# EAGLE design esptoy_v13 (EAGLE 7.7.0)
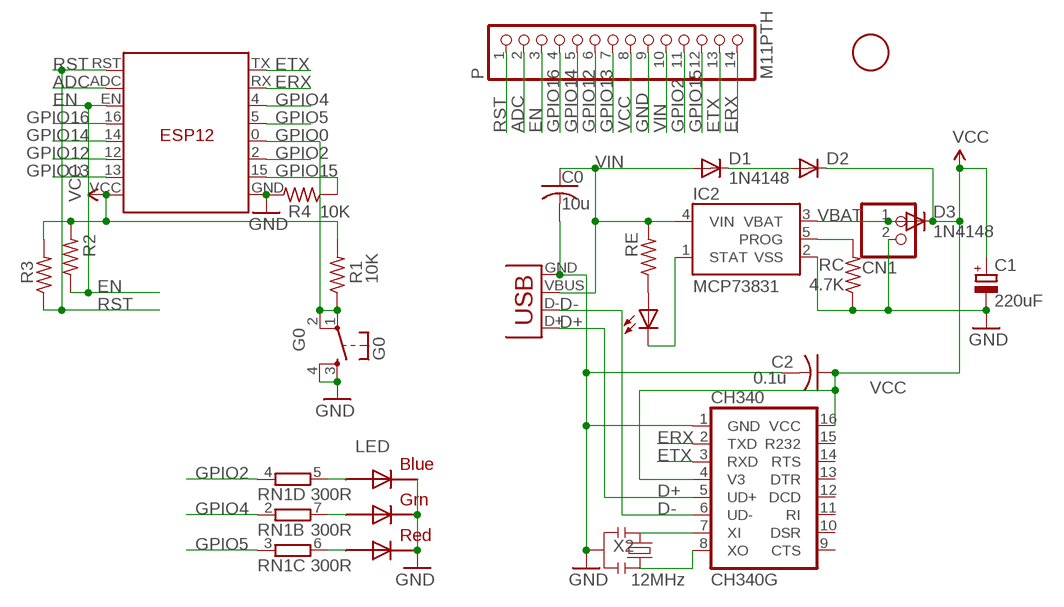
[diagram p0: schematic, sheet 1]

## Parts
1F  FIDUCIAL  [FIDUCIAL_1MM]
C0  10u  C-USC0805K  [C0805K]
C1  220uF  CPOL-EUCT3528  [CT3528]
C2  0.1u  C-USC0603K  [C0603K]
CH340  CH340G  [SO16]
CHG  0805  LEDCHIPLED_0805  [CHIPLED_0805]
CN1  JST_2PIN-SMT-RA  [JST-PH-2-SMT-RA]
D1  1N4148  DIODE-DO-214AC  [DO-214AC]
D2  DIODE-DO-214AC  [DO-214AC]
D3  1N4148  DIODE-DO-214AC  [DO-214AC]
G0  G0  TAC_SWITCHSMD  [TACTILE_SWITCH_SMD]
IC2  MCP73831  [SOT23-5]
LED  RGBLED5050  [RGBLED5050]
P  M11PTH  PINHD-1X14-CB  [1X14-CB]
R1  10K  R-US_R0603  [R0603]
R2  R-US_R0603  [R0603]
R3  R-US_R0603  [R0603]
R4  10K  R-US_R0603  [R0603]
RC  4.7K  R-US_R0603  [R0603]
RE  R-US_R0603  [R0603]
RN1  300R  4R-NEXB38V  [EXB38V]
U$1  ESP12  [ESP12]
X2  12MHz  RESONATORSMD  [RESONATOR-SMD]
X3  USBMICROB2  [USB-MICROB2]

## Nets
ADC: P.2 U$1.ADC
D+: CH340.5(UD+) X3.D+
D-: CH340.6(UD-) X3.D-
EN: P.3 R2.1 U$1.EN
ERX: CH340.2(TXD) P.14 U$1.RX
ETX: CH340.3(RXD) P.13 U$1.TX
GND: C0.2 C1.- C2.2 CH340.1(GND) CN1.2 G0.3 G0.4 IC2.2(VSS) LED.4(BLUE_C) LED.5(RED_C) LED.6(GREEN_C) P.9 R4.2 RC.1 U$1.GND X2.2 X3.GND
GPIO0: G0.1 G0.2 R1.1 U$1.0(G0)
GPIO2: P.11 RN1.4 U$1.2(G2)
GPIO4: RN1.2 U$1.4(G4)
GPIO5: RN1.3 U$1.5(G5)
GPIO12: P.6 U$1.12(G12)
GPIO13: P.7 U$1.13(G13)
GPIO14: P.5 U$1.14(G14)
GPIO15: P.12 R4.1 U$1.15(G15)
GPIO16: P.4 U$1.16(G16)
N$1: D1.C D2.A
N$2: LED.3(BLUE_A) RN1.5
N$3: IC2.5(PROG) RC.2
N$4: CHG.A RE.1
N$5: CHG.C IC2.1(STAT)
N$6: LED.1(GREEN_A) RN1.7
N$7: LED.2(RED_A) RN1.6
N$11: CH340.7(XI) X2.1
N$13: CH340.8(XO) X2.3
RST: P.1 R3.1 U$1.RST
VBAT [power]: CN1.1 D3.A IC2.3(VBAT)
VCC [power]: C1.+ C2.1 CH340.4(V3) CH340.16(VCC) D2.C D3.C P.8 R1.2 R2.2 R3.2 U$1.VCC
VIN [power]: C0.1 D1.A IC2.4(VIN) P.10 RE.2 X3.VBUS
Unconnected: CH340.9(CTS) CH340.10(DSR) CH340.11(RI) CH340.12(DCD) CH340.13(DTR) CH340.14(RTS) CH340.15(R232) RN1.1 RN1.8

## Library data of the parts
1F = adafruitGood:FIDUCIAL: For use by pick and place machines to calibrate the vision/machine, 1mm By microbuilder.eu
C0 = adafruit2013:C-US: CAPACITOR, American symbol
C1 = rcl:CPOL-EU: POLARIZED CAPACITOR, European symbol
C2 = adafruit:C-US: CAPACITOR, American symbol
CH340 = SparkFunNew:CH340
CHG = led:LED: LED OSRAM: - CHIPLED LG R971, LG N971, LY N971, LG Q971, LY Q971, LO R971, LY R971 LH N974, LH R974 LS Q976, LO Q976, LY Q976 LO Q996 - Hyper CHIPLED LW Q18S LB Q993, LB Q99A, LB R99A - SideLED LS A670, LO A670, LY A670, LG A670, LP A670 LB A673, LV A673, LT A673, LW A673 LH A674 LY A675 LS A676, LA A676, LO A676, LY A676, LW A676 LS A679, LY A679, LG A679 - Hyper Micro SIDELED® LS Y876, LA Y876, LO Y876, LY Y876 LT Y87S - SmartLED LW L88C, LW L88S LB L89C, LB L89S, LG L890 LS L89K, LO L89K, LY L89K LS L896, LA L896, LO L896, LY L896 - TOPLED LS T670, LO T670, LY T670, LG T670, LP T670 LSG T670, LSP T670, LSY T670, LOP T670, LYG T670 LG T671, LOG T671, LSG T671 LB T673, LV T673, LT T673, LW T673 LH T674 LS T676, LA T676, LO T676, LY T676, LB T676, LH T676, LSB T676, LW T676 LB T67C, LV T67C, LT T67C, LS T67K, LO T67K, LY T67K, LW E67C LS E67B, LA E67B, LO E67B, LY E67B, LB E67C, LV E67C, LT E67C LW T67C LS T679, LY T679, LG T679 LS T770, LO T770, LY T770, LG T770, LP T770 LB T773, LV T773, LT T773, LW T773 LH T774 LS E675, LA E675, LY E675, LS T675 LS T776, LA T776, LO T776, LY T776, LB T776 LHGB T686 LT T68C, LB T68C - Hyper Mini TOPLED® LB M676 - Mini TOPLED Santana® LG M470 LS M47K, LO M47K, LY M47K Source: http://www.osram.convergy.de LUXEON: - LUMILED® LXK2-PW12-R00, LXK2-PW12-S00, LXK2-PW14-U00, LXK2-PW14-V00 LXK2-PM12-R00, LXK2-PM12-S00, LXK2-PM14-U00 LXK2-PE12-Q00, LXK2-PE12-R00, LXK2-PE12-S00, LXK2-PE14-T00, LXK2-PE14-U00 LXK2-PB12-K00, LXK2-PB12-L00, LXK2-PB12-M00, LXK2-PB14-N00, LXK2-PB14-P00, LXK2-PB14-Q00 LXK2-PR12-L00, LXK2-PR12-M00, LXK2-PR14-Q00, LXK2-PR14-R00 LXK2-PD12-Q00, LXK2-PD12-R00, LXK2-PD12-S00 LXK2-PH12-R00, LXK2-PH12-S00 LXK2-PL12-P00, LXK2-PL12-Q00, LXK2-PL12-R00 Source: www.luxeon.com KINGBRIGHT: KA-3528ASYC Source: www.kingbright.com
CN1 = adafruit:JST_2PIN: JST 2-Pin Connectors of various flavors SMT-RA (S2B-PH-SM4) 4UConnector #17311 SMT (B2B-PH-SM4) THM-RA (S2B-PH) THM (B2B-PH)
D1-D3 = diode:DIODE-: DIODE
G0 = SparkFunNew:TAC_SWITCH: Momentary Switch Button commonly used for reset or general input. Spark Fun Electronics SKU : COM-00097
IC2 = SparkFunNew:MCP73831: Microchip's MCP73831 Miniature single cell, fully integrated Li-Ion, Li-polymer charge management controller http://ww1.microchip.com/downloads/en/DeviceDoc/21984a.pdf
LED = adafruit:RGBLED: For 5050 RGB LEDs, the order of the LEDs may vary from one manufacturer to another!
P = adafruit:PINHD-1X14: PIN HEADER
R1-R4 RE = adafruit (picker 的冲突副本 2014-10-29):R-US_: RESISTOR, American symbol
RC = adafruit2013:R-US_: RESISTOR, American symbol
RN1 = resistor-dil:4R-N: Array Chip Resistor Source: RS Component / Phycomp; OC_FARNELL: unknown; OC_NEWARK: unknown
U$1 = JeeParts:ESP12
X2 = SparkFunNew:RESONATOR: Resonator Small SMD resonator. This is the itty bitty 10/20MHz resonators with built in caps. CSTCE10M0G55 and CSTCE20M0V53. Footprint has been reviewed closely but hasn't been tested yet.
X3 = SparkFunNew:USB: USB Connectors USB-B-PTH is fully proven SKU : PRT-00139 USB-miniB is fully proven SKU : PRT-00587 USB-A-PCB is untested. USB-A-H is throughly reviewed, but untested. Spark Fun Electronics SKU : PRT-00437 USB-B-SMT is throughly reviewed, but untested. Needs silkscreen touching up. USB-A-S has not been used/tested USB-MB-H has not been used/tested

## Net classes
0 default: width 0.254 mm, clearance 0.178 mm
1 power: width 0.254 mm, clearance 0.178 mm
2 relaypower: width 0.508 mm, clearance 0.305 mm

## Board
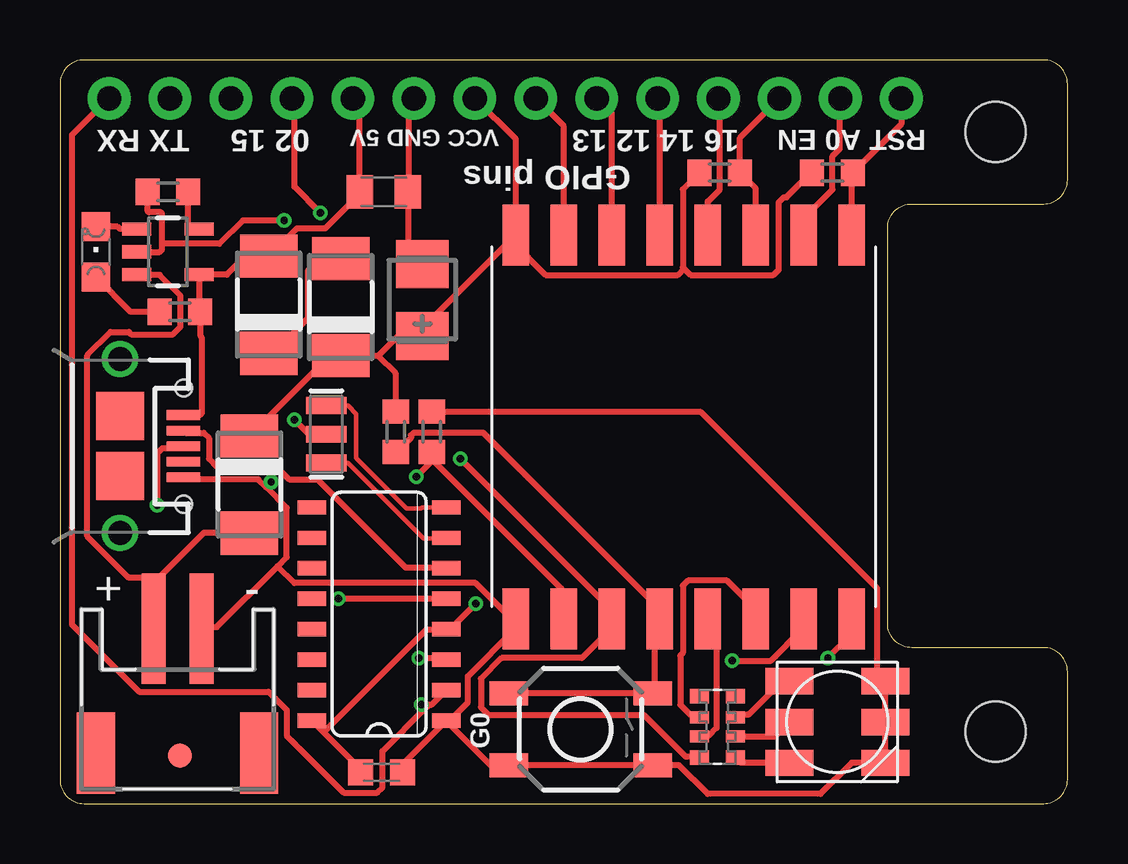
[diagram p1: board, top side]
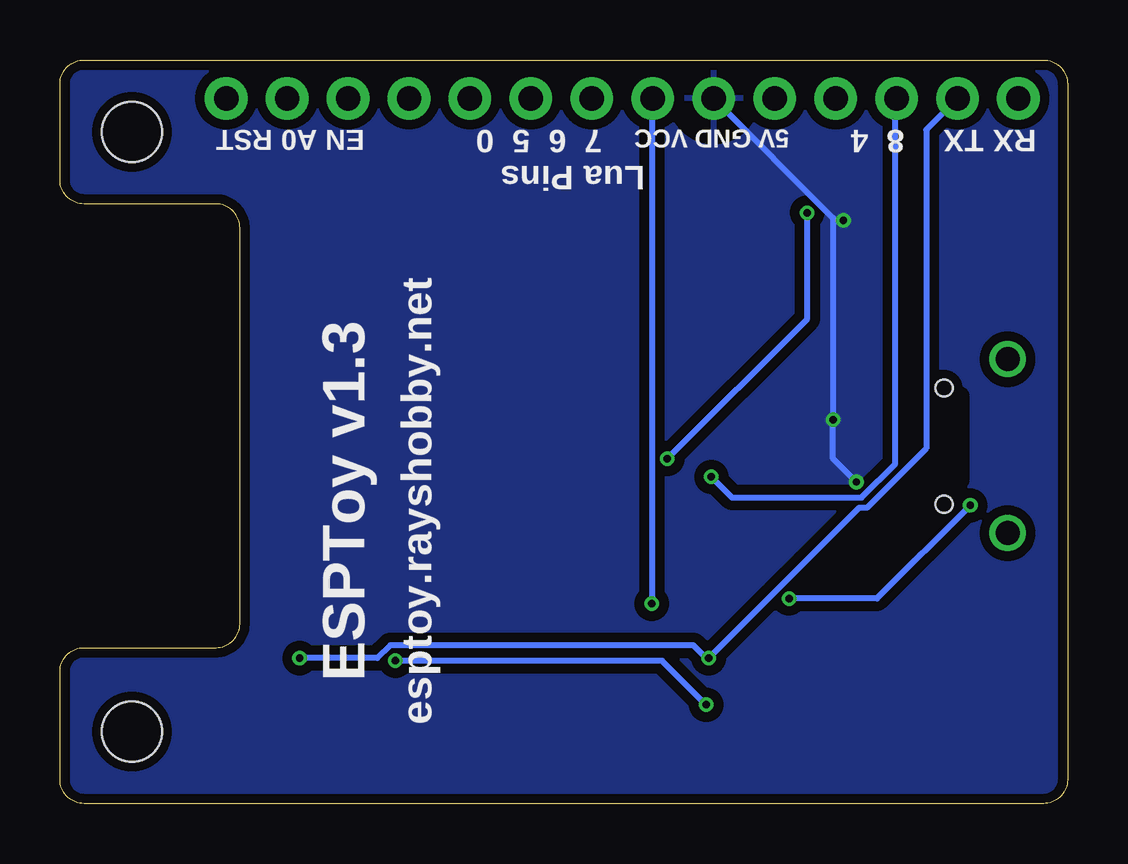
[diagram p2: board, bottom side, seen from below]

Size 42 x 31 mm. Coordinates in mm from the lower left corner, seen from the top.
Outline: 0,30 0,1 arc90 1,0 41,0 arc90 42,1 42,5.5 arc90 41,6.5 35.5,6.5 arc-90 34.5,7.5 34.5,24 arc-90 35.5,25 41,25 arc90 42,26 42,30 arc90 41,31 1,31 arc90 0,30
Copper layers (1*16): Top 0.035mm / dielectric 1.5mm / Bottom 0.035mm
Design rules "Fusion_eagle_rule_v1.1 *": minimum track width 6mil, minimum drill 12mil, track to track 6mil, track to pad 6mil, pad to pad 6mil, via to via 6mil, smd to smd 0mil, copper to edge 10mil, drill to drill 10mil, minimum pad ring 10mil, minimum via ring 6mil, stop-mask expansion 2mil, vias tented up to drill 100mil, thermal gap 40mil
Holes 2.5 mm at 39,3 39,28
tRestrict: area 37.2,1.2 to 40.8,4.8; area 37.2,26.2 to 40.8,29.8
bRestrict: area 4.5,13.5 to 5.5,17
vRestrict: area 1.2,27.1 to 35.8,28.1

### Footprints (pad centres in the part's own frame; a part is rotated, then mirrored left to right if it is on the bottom)
FIDUCIAL_1MM = smd 1 x 1: 1 0,0
C0805K = smd 1.1 x 1.4: 1 -1,0; 2 1,0
CT3528 = smd 2 x 2.2: + -1.5,0; - 1.5,0
C0603K = smd 1.05 x 1.08: 1 -0.875,0; 2 0.875,0
SO16 = smd 0.6 x 1.2: 1 -4.445,-2.8; 2 -3.175,-2.8; 3 -1.905,-2.8; 4 -0.635,-2.8; 5 0.635,-2.8; 6 1.905,-2.8; 7 3.175,-2.8; 8 4.445,-2.8; 9 4.445,2.8; 10 3.175,2.8; 11 1.905,2.8; 12 0.635,2.8; 13 -0.635,2.8; 14 -1.905,2.8; 15 -3.175,2.8; 16 -4.445,2.8
CHIPLED_0805 = smd 1.2 x 1.2: A 0,-1.05; C 0,1.05
JST-PH-2-SMT-RA = smd 1 x 4.6: 1 1,-3.7; 2 -1,-3.7 | smd 1.6 x 3.4: NC1 -3.4,1.5; NC2 3.4,1.5
DO-214AC = smd 1.8 x 2.4: A 2.025,0; C -2.025,0
TACTILE_SWITCH_SMD = smd 1.6 x 1: 1 -3,1.5; 2 3,1.5; 3 -3,-1.5; 4 3,-1.5
SOT23-5 = smd 0.55 x 1.2: 1 -0.95,-1.3; 2 0,-1.3; 3 0.95,-1.3; 4 0.95,1.3; 5 -0.95,1.3
RGBLED5050 = smd 2 x 1.1: 1 -2,1.7; 2 -2,0; 3 -2,-1.7; 4 2,-1.7; 5 2,0; 6 2,1.7
1X14-CB = drill 1.016 pad 1.778: 1 -16.51,0; 2 -13.97,0; 3 -11.43,0; 4 -8.89,0; 5 -6.35,0; 6 -3.81,0; 7 -1.27,0; 8 1.27,0; 9 3.81,0; 10 6.35,0; 11 8.89,0; 12 11.43,0; 13 13.97,0; 14 16.51,0
R0603 = smd 1 x 1.1: 1 -0.85,0; 2 0.85,0
EXB38V = smd 0.6 x 0.8: 1 -1.275,-0.75; 4 1.275,-0.75; 5 1.275,0.75; 8 -1.275,0.75 | smd 0.5 x 0.8: 2 -0.4,-0.75; 3 0.4,-0.75; 6 0.4,0.75; 7 -0.4,0.75
ESP12 = smd 2.54 x 1.1: 0 8,-1; 2 8,-3; 4 8,3; 5 8,1; 12 -8,-3; 13 -8,-5; 14 -8,-1; 15 8,-5; 16 -8,1; ADC -8,5; EN -8,3; GND 8,-7; RST -8,7; RX 8,5; TX 8,7; VCC -8,-7
RESONATOR-SMD = smd 0.7 x 1.7: 1 -1.2,0; 2 0,0; 3 1.2,0
USB-MICROB2 = smd 0.4 x 1.4: D+ 0,2.65; D- -0.65,2.65; GND 1.3,2.65; ID 0.65,2.65; VBUS -1.3,2.65 | drill 1: MT1 -3.625,0; MT2 3.625,0 | smd 2 x 2: MT3 1.25,0; MT4 -1.25,0 | hole 0.7: -2.425,2.65; 2.425,2.65

### Placement (x,y rotation side)
1F  5,2 180 top
C0  13.5,25.5 0 top
C1  15.1,21 90 top
C2  13.4,1.3 0 top
CH340  13.3,7.9 90 top
CHG  1.5,23 0 top
CN1  4.9,3.6 180 top
D1  8.7,20.8 90 top
D2  11.7,20.7 90 top
D3  7.9,13.3 270 top
G0  21.7,3.1 0 top
IC2  4.5,23 270 top
LED  32.4,3.4 0 top
P  18.56,29.4 180 top
R1  14,15.5 90 top
R2  27.5,26.3 180 top
R3  32.2,26.3 180 top
R4  15.5,15.5 90 top
RC  4.5,25.5 0 top
RE  5,20.5 0 top
RN1  27.4,3.2 270 top
U$1  26,15.7 270 top
X2  11.1,15.4 90 top
X3  2.5,14.9 270 top

### Tracks (layer width: path | path; a pad name or v marks a point on that pad's centre or on a via)
ADC
  Top 0.254: U$1.ADC 31,24.7 31.1,24.8 31.4,24.8 32.2,25.6 32.2,27 32.5,27.3 32.5,29.4 P.2
D+  (via drill 0.3)
  Top 0.254: v11.61,8.55 16.04,8.55 CH340.5 | v4.05,12.43 4.05,14.59 4.27,14.81 5.13,14.81 X3.D+
  Bottom 0.254: v11.61,8.55 7.94,8.55 v4.05,12.43
D-
  Top 0.254: CH340.6 16.04,9.84 14.42,9.84 10.75,13.51 9.56,13.51 9.02,14.05 6.54,14.05 6.21,14.38 6.21,15.24 6,15.46 5.24,15.46 X3.D-
EN
  Top 0.254: U$1.EN 29,25.65 R2.1 28.35,27.76 P.3
ERX  (via drill 0.3)
  Top 0.254: 15.22,3.96 13.44,2.18 13.44,0.67 13.23,0.45 11.82,0.45 9.45,2.83 9.45,3.9 8.69,4.66 3.3,4.66 0.49,7.47 0.49,27.87 2,29.38 P.14 | 15.22,3.96 15.39,4.12 15.49,4.12 16.04,4.66 CH340.2 | v28.02,5.96 29.64,5.96 30.93,7.25 30.93,7.68 U$1.RX | 15.22,3.96 v15.06,4.12
  Bottom 0.254: v28.02,5.96 16.9,5.96 v15.06,4.12
ETX  (via drill 0.3)
  Top 0.254: v14.96,6.06 16.04,6.06 CH340.3 | v32.01,6.06 32.98,7.04 32.98,7.68 U$1.TX
  Bottom 0.254: P.13 4.59,29.38 5.89,28.09 5.89,14.81 8.37,12.32 8.69,12.32 v14.96,6.06 15.06,6.06 15.6,6.6 28.23,6.6 28.77,6.06 v32.01,6.06
GND  (via drill 0.3)
  Top 0.254: C2.2 14.28,1.63 CH340.1 | CH340.1 17.95,1.6 G0.3 G0.4 25.8,1.6 27,0.4 31.7,0.4 33,1.7 LED.4 LED.5 LED.6 34.39,5.2 34.06,5.52 34.06,8.98 26.72,16.32 15.6,16.32 R4.2 | RC.1 3.65,24.7 3.7,24.65 4.2,24.65 4.25,24.6 4.25,23.34 | 4.25,23.34 4.25,23.1 4.15,23 IC2.2 | C1.- 15.06,22.58 14.52,23.12 14.52,25.5 C0.2 14.52,25.6 14.52,29.16 14.74,29.38 P.9 | v9.77,15.99 10.31,15.46 11.07,15.46 X2.2 | 4.25,23.34 6.64,23.34 7.62,24.31 v9.34,24.31 | 8.59,13.19 9.45,12.32 9.45,10.27 9.07,9.9 | 8.59,13.19 8.26,13.51 5.24,13.51 X3.GND | 9.07,9.9 6.54,7.36 6,7.36 CN1.2 | CH340.1 16.25,3.47 17.01,4.23 17.01,5.31 18.95,7.25 18.95,7.68 U$1.GND 18.84,7.68 17.33,9.19 9.77,9.19 9.07,9.9 | 8.59,13.19 v8.8,13.4
  Bottom 0.254: 9.77,24.31 9.77,24.41 14.74,29.38 P.9 | 9.77,24.31 v9.77,15.99 9.77,14.38 v8.8,13.4 | 9.77,24.31 v9.34,24.31
  pour Bottom (isolate 0.406): 42,0 0,0 0,31 42,31
GPIO0
  Top 0.254: G0.1 G0.2 24.78,4.66 24.78,7.36 25,7.58 U$1.0 25,7.79 25,8.12 17.65,15.46 14.74,15.46 14.63,15.35 14.63,15.24 14.09,14.7 R1.1
GPIO2  (via drill 0.3)
  Top 0.254: RN1.4 26.61,1.96 26.07,1.96 24.35,3.69 17.87,3.69 17.55,4.01 17.55,5.2 18.41,6.06 21.76,6.06 22.94,7.25 22.94,7.68 U$1.2 22.94,7.79 22.94,8.12 v16.68,14.38 | v10.85,24.63 9.77,25.71 9.77,29.38 P.11
  Bottom 0.254: v10.85,24.63 10.85,20.2 v16.68,14.38
GPIO4
  Top 0.254: RN1.2 26.61,3.69 26.29,3.69 25.86,4.12 25.86,6.17 25.97,6.28 25.97,9.09 26.18,9.3 27.8,9.3 28.99,8.12 28.99,7.79 U$1.4
GPIO5
  Top 0.254: RN1.3 26.72,2.83 27.05,2.83 27.37,3.15 27.37,7.36 27.05,7.68 U$1.5
GPIO12
  Top 0.254: U$1.12 23,28.77 P.6
GPIO13
  Top 0.254: U$1.13 21,28.23 P.7
GPIO14
  Top 0.254: U$1.14 25,29.31 P.5
GPIO15  (via drill 0.3)
  Top 0.254: U$1.15 20.89,7.79 20.89,8.98 15.6,14.27 15.6,14.59 R4.1 15.49,14.27 v14.85,13.62
  Bottom 0.254: v14.85,13.62 13.98,12.76 8.59,12.76 7.18,14.16 7.18,29.38 P.12
GPIO16
  Top 0.254: U$1.16 27,25.1 27.5,25.6 27.5,29.4 P.4
N$1
  Top 0.254: D2.A 11.7,22.7 10.8,22.7 10.35,22.25 10.35,20.25 9.75,19.65 9.75,18.8 9.7,18.75 8.7,18.75 D1.C
N$2
  Top 0.254: LED.3 28.38,1.7 RN1.5
N$3
  Top 0.254: RC.2 5.35,23.95 IC2.5
N$4
  Top 0.254: RE.1 2.95,20.5 CHG.A
N$5
  Top 0.254: CHG.C 2.4,24.05 2.5,23.95 IC2.1
N$6
  Top 0.254: LED.1 30.1,5.1 28.7,3.7 28.25,3.7 RN1.7
N$7
  Top 0.254: RN1.6 29.8,2.8 LED.2
N$11
  Top 0.18: X2.1 12,14.2 15.15,11.05 16.1,11.05 CH340.7
N$13
  Top 0.18: X2.3 12,16.6 12.35,16.25 12.35,14.4 14.45,12.3 15.05,12.3 15.1,12.35 CH340.8
RST
  Top 0.254: U$1.RST 33,26.25 R3.1 35.07,28.32 P.1
VBAT
  Top 0.254: D3.A 7.9,11.3 6,11.3 4,9.3 4,8.8 3.9,8.7 CN1.1 3.94,9.41 2.87,9.41 1.14,11.14 1.14,18.69 2.11,19.66 2.87,19.66 2.97,19.56 4.7,19.56 5.02,19.88 5.02,21.18 4.16,22.04 3.3,22.04 IC2.3
VCC  (via drill 0.3)
  Top 0.254: C2.1 12.53,1.43 10.99,2.96 | 10.99,2.96 CH340.16 | U$1.VCC 19,27.69 P.8 | 13.26,18.66 14.1,19.5 C1.+ 15.17,19.56 15.17,19.88 18.95,23.66 U$1.VCC | 13.26,18.66 13.25,18.65 11.7,18.65 D2.C 11.25,18.68 D3.C | 26.02,22.31 25.97,22.36 25.97,25.6 26.61,26.25 R2.2 | 26.02,22.31 26.29,22.04 29.75,22.04 29.96,22.26 29.96,25.06 30.18,25.28 30.29,25.28 31.26,26.25 R3.2 | 10.99,2.96 15.28,7.25 16.04,7.25 CH340.4 16.14,7.36 16.36,7.36 v17.33,8.33 | 13.26,18.66 13.98,17.94 13.98,16.43 R1.2 | 26.02,22.31 25.75,22.04 20.25,22.04 18.84,23.44 U$1.VCC
  Bottom 0.254: v17.33,8.33 17.33,29.38 P.8
VIN
  Top 0.254: X3.VBUS 5.85,16.2 5.9,16.25 5.9,19.45 5.85,19.5 RE.2 5.8,20.55 IC2.4 6.95,22.05 7.7,22.8 8.7,22.8 D1.A 8.8,22.9 9.88,23.98 11.07,23.98 12.47,25.39 C0.1 12.47,25.6 12.47,29.16 12.26,29.38 P.10

### Text on the board
tPlace: TX RX | 02 15 | VCC GND 5V | 16 14 12 13 | RST A0 EN | GPIO pins
bPlace: RX TX | 8 4 | 5V GND VCC | 7 6 5 0 | EN A0 RST | Lua Pins
bNames: ESPToy v1.3 | esptoy.rayshobby.net